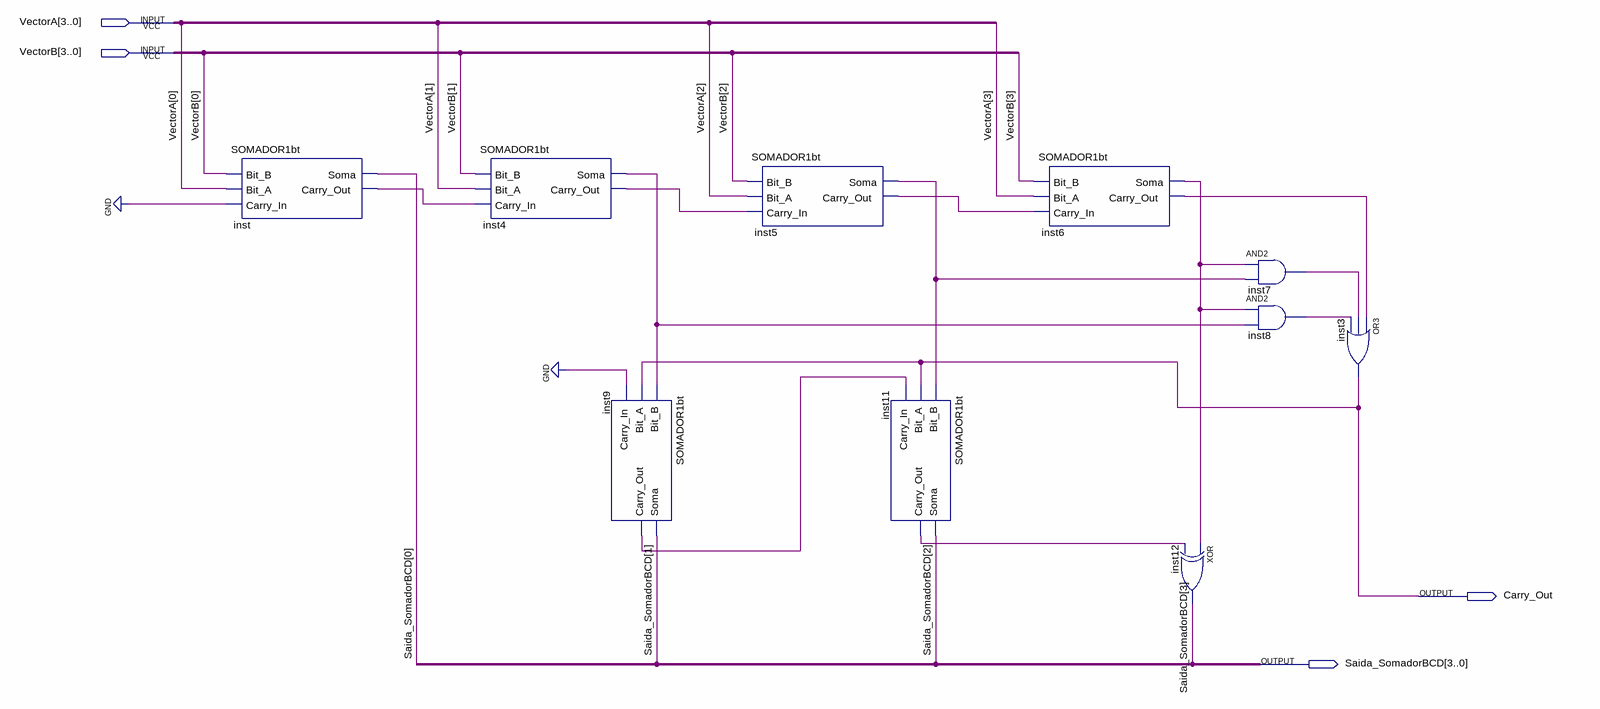
[diagram p0: schematic sheet]
// Quartus schematic SOMADORbcd.bdf as structural Verilog: 10 symbols, 4 pins
module SOMADORbcd (
  input  [3:0] VectorA,
  input  [3:0] VectorB,
  output Carry_Out,
  output [3:0] Saida_SomadorBCD
);

  wire inst4_carry_out, inst4_soma, inst5_carry_out, inst5_soma, inst6_carry_out, inst6_soma, inst7_out,
       inst8_out, inst9_carry_out, inst11_carry_out, inst_carry_out;

  SOMADOR1bt inst (
    .Bit_B(VectorB[0]), .Bit_A(VectorA[0]), .Carry_In(1'b0), .Soma(Saida_SomadorBCD[0]),
    .Carry_Out(inst_carry_out));
  SOMADOR1bt inst4 (
    .Bit_B(VectorB[1]), .Bit_A(VectorA[1]), .Carry_In(inst_carry_out), .Soma(inst4_soma),
    .Carry_Out(inst4_carry_out));
  SOMADOR1bt inst9 (
    .Bit_B(inst4_soma), .Bit_A(Carry_Out), .Carry_In(1'b0), .Soma(Saida_SomadorBCD[1]),
    .Carry_Out(inst9_carry_out));
  SOMADOR1bt inst5 (
    .Bit_B(VectorB[2]), .Bit_A(VectorA[2]), .Carry_In(inst4_carry_out), .Soma(inst5_soma),
    .Carry_Out(inst5_carry_out));
  SOMADOR1bt inst11 (
    .Bit_B(inst5_soma), .Bit_A(Carry_Out), .Carry_In(inst9_carry_out), .Soma(Saida_SomadorBCD[2]),
    .Carry_Out(inst11_carry_out));
  SOMADOR1bt inst6 (
    .Bit_B(VectorB[3]), .Bit_A(VectorA[3]), .Carry_In(inst5_carry_out), .Soma(inst6_soma),
    .Carry_Out(inst6_carry_out));
  xor inst12 (Saida_SomadorBCD[3], inst6_soma, inst11_carry_out);
  and inst7 (inst7_out, inst6_soma, inst5_soma);
  and inst8 (inst8_out, inst6_soma, inst4_soma);
  or inst3 (Carry_Out, inst6_carry_out, inst7_out, inst8_out);
endmodule
